# Altium schematic sheet BME280.SchDoc
size A4; SheetNumber: 1; SheetTotal: 1
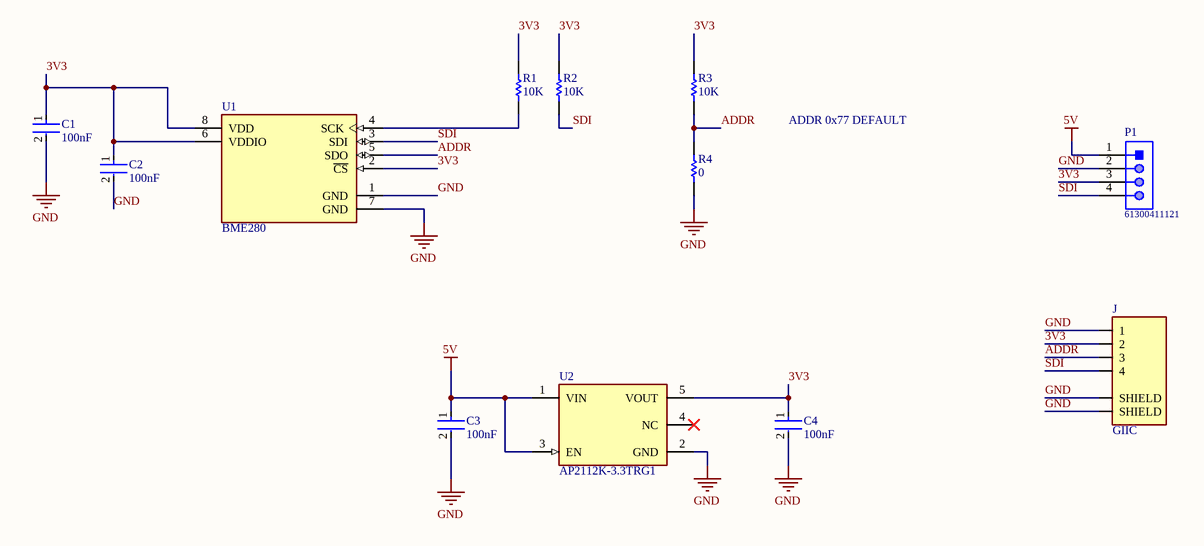
[diagram p0: BME280.SchDoc]

## Parts
C1  100nF  [FP-C0805C-DN-MFG]
C2  100nF  [FP-C0805C-DN-MFG]
C3  100nF  [FP-C0805C-DN-MFG]
C4  100nF  [FP-C0805C-DN-MFG]
J  GIIC  [JST_SM04B-SRSS-TB(LF)(SN)]
P1  61300411121  [61300411121]
R1  10K  [RESC2013X60X40LL20T25_A]
R2  10K  [RESC2013X60X40LL20T25_A]
R3  10K  [RESC2013X60X40LL20T25_A]
R4  0  [RESC2013X60X40LL20T25_A]
U1  BME280  [FP-BME280-MFG]
U2  AP2112K-3.3TRG1  [FP-SOT25-IPC_A]

## Nets
5V: C3.1 P1.1 U2.1(VIN) U2.3(EN)
GND: C1.2 C2.2 C3.2 C4.2 J.1 J.S1(SHIELD) J.S2(SHIELD) P1.2 R4.1 U1.1(GND) U1.7(GND) U2.2(GND)
3V3: C1.1 C2.1 C4.1 J.2 P1.3 R1.2 R2.2 R3.2 U1.2(~{CS}) U1.6(VDDIO) U1.8(VDD) U2.5(VOUT)
ADDR: J.3 R3.1 R4.2 U1.5(SDO)
SDI: J.4 P1.4 R2.1 U1.3(SDI)
NetR1_1: R1.1 U1.4(SCK)

Not connected (* = marked no-connect by the designer): U2 4(NC)*

## Notes on the sheet
- ADDR 0x77 DEFAULT

## Library data of the parts
C1-C4 = CMP-2007-00279-2: CAP CER 0.1UF 50V X7R 0805; Manufacturer Part Number: C0805C104K5RACTU; Manufacturer: KEMET; Value: 0.10 μF; Description: C0805 0.10 μF X7R 30ppm/°C 10.00% 50 V; Tolerance: 0.1; Temperature Coefficient: 30ppm/°C; Material: Ceramic; Device Class L2: Capacitors; Temperature Range Low: -55°C; Voltage Rating: 50 V; Digikey Description: CAP CER 0.1UF 50V X7R 0805; Category: Cap; ComponentLink2Description: Datasheet; Octopart: https://octopart.com/c0805c104k5ractu-kemet-143926; RoHS: TRUE; ComponentLink2URL: https://content.kemet.com/datasheets/KEM_C1003_C0G_SMD.pdf; Temperature Characteristic: X7R; Temperature: -55°C to +125°C; Height: 0.88mm; Temperature Range High: +125°C; Device Class L1: Passive Components; Automotive: No; Lead Free: Yes; Ipc Land Pattern Name: CAPC200125X78; Device Class L3: Ceramic Capacitors; Mouser Description: Cap Ceramic 0.1uF 50V X7R 10% SMD 2.0 x 1.2 mm 125 C Paper T/R; Capacitance: 0.10 μF; Package: C0805C-DN
J = SM04B-SRSS-TB(LF)(SN): Connector Header Surface Mount, Right Angle 4 position 0.039 _1.00mm_; MF: JST Sales; MP: SM04B-SRSS-TB_LF__SN_; Price: None; SnapEDA_Link: https://www.snapeda.com/parts/SM04B-SRSS-TB%28LF%29%28SN%29/JST%20Sales%20America%20Inc./view-part/557466/?ref=snap; Value: *; Availability: Unavailable; Package: None
P1 = CMP-1502-01064-1: THT Vertical Pin Header WR-PHD, Pitch 2.54 mm, Single Row, 4 pins; Manufacturer: Wurth Elektronik; Withstanding Voltage: 500VAC; Rated Current: 3A; Working Voltage: 250VAC; Pin Number: 4; Gender: Male; Contact Resistance: 20mOhm; Pitch: 2.54mm; Manufacturer URL: http://www.we-online.de; Operating Temperature: -40to105degC; Packaging: Bag; Mounting Technology: THT; Package Reference: 61300411121; Datasheet URL: https://katalog.we-online.de/em/datasheet/6130xx11121.pdf; Publisher: WurthElektronik; Part Number: 61300411121; Row Number: Single; Orientation: Vertical
R1-R4 = CMP-2001-00582-2: Metal Film Chip Resistor, High Reliability Type, 0.125 W, +/- 0.1%, -55 to 155 degC, 0805 (2012 Metric), RoHS, Tape and Reel; Voltage Rating: 100V; Power Rating: 125mW(1/8W); Brand: Panasonic; Temperature Coefficient: 25PPM/C; Resistance: 10kOhms; Product Category: ThinFilmResistors-SMD; Datasheet Version: 02/2016; Operating Temperature Range: -55Cto+155C; Length: 2mm; Mounting Technology: SurfaceMount; Manufacturer URL: http://www.panasonic.com/; Width: 1.25mm; Packaging: Reel; Product: ThinFilmResistorsSMD; Package / Case: 0805(2012metric); Termination Style: SMD/SMT; Tolerance: 0.1%; Datasheet URL: https://industrial.panasonic.com/cdbs/www-data/pdf/RDM0000/AOA0000C307.pdf; Package Description: 2-Pin Surface Mount Device, Body 2 x 1.25 mm; Factory Pack Quantity: 5000; Series: ERA-6A; Case Code - mm: 2012; RoHS: Details; Package Reference: 0805; Height: 0.5mm; Manufacturer: Panasonic; Case Code - in: 0805; Type: MetalFilmChipResistors
U1 = CMP-2000-05073-3: SENSOR PRESSURE HUMIDITY TEMP; Sensor Type: Temperature; Accuracy: 3%; Response Time: 1s; Output Type: SPI; Min Operating Temperature: -40°C; Max Operating Temperature: 85°C; Case/Package: LGA; Packaging: Cut Tape; Mount: Surface Mount; Lead Free: Lead Free; Number of Pins: 8
U2 = CMP-12756-000035-1: IC REG LINEAR 3.3V 600MA SOT25; Number of Regulators: 1; Output Type: Fixed; Polarity: Positive; Min Input Voltage: 2.5V; Max Input Voltage: 6V; Accuracy: 1.5%; Quiescent Current: 55uA; Dropout Voltage: 250mV; Min Operating Temperature: -40°C; Length: 3.1mm; Output Current: 600mA; Max Operating Temperature: 85°C; Package Quantity: 1; Output Voltage: 3.3V; Width: 1.7mm; Number of Outputs: 1; Packaging: Tape and Reel; Height: 1.3mm; Lead Free: Lead Free; Max Output Current: 600mA; Case/Package: SOT-23-5; Mount: Surface Mount; Number of Pins: 5